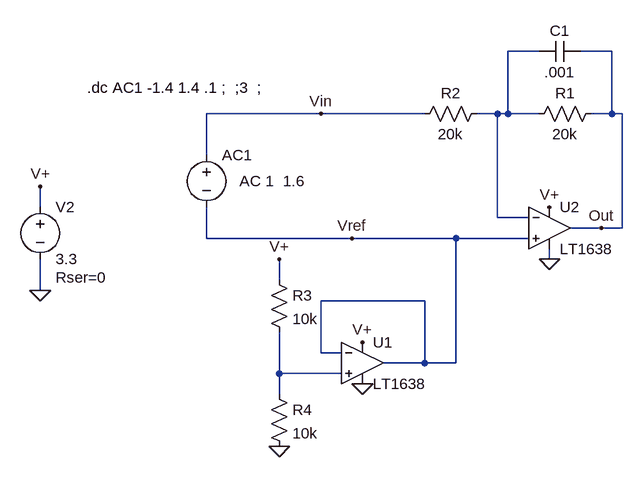
[diagram p0: schematic Current Sensor Amp 1.asc]
Current Sensor Amp 1.asc, the LTspice schematic file:
Version 4
SHEET 1 880 680
WIRE 240 -112 192 -112
WIRE 352 -112 304 -112
WIRE -96 -16 -272 -16
WIRE 64 -16 -96 -16
WIRE 176 -16 144 -16
WIRE 192 -16 192 -112
WIRE 192 -16 176 -16
WIRE 240 -16 192 -16
WIRE 352 -16 352 -112
WIRE 352 -16 320 -16
WIRE 368 -16 352 -16
WIRE -272 48 -272 -16
WIRE -528 128 -528 96
WIRE 176 144 176 -16
WIRE 224 144 176 144
WIRE 336 160 288 160
WIRE 368 160 368 -16
WIRE 368 160 336 160
WIRE -272 176 -272 128
WIRE -48 176 -272 176
WIRE 112 176 -48 176
WIRE 224 176 112 176
WIRE 256 208 256 192
WIRE -160 240 -160 208
WIRE -528 256 -528 208
WIRE 64 272 -96 272
WIRE -96 352 -96 272
WIRE -64 352 -96 352
WIRE 64 368 64 272
WIRE 64 368 0 368
WIRE 112 368 112 176
WIRE 112 368 64 368
WIRE -160 384 -160 320
WIRE -64 384 -160 384
WIRE -160 416 -160 384
FLAG 256 208 0
FLAG 256 128 V+
FLAG 336 160 Out
FLAG -528 256 0
FLAG -528 96 V+
FLAG -48 176 Vref
FLAG -96 -16 Vin
FLAG -32 400 0
FLAG -32 336 V+
FLAG -160 496 0
FLAG -160 208 V+
SYMBOL res 336 -32 R90
WINDOW 0 0 56 VBottom 2
WINDOW 3 32 56 VTop 2
SYMATTR InstName R1
SYMATTR Value 20k
SYMBOL Opamps\\LT1638 256 96 R0
SYMATTR InstName U2
SYMBOL res 160 -32 R90
WINDOW 0 0 56 VBottom 2
WINDOW 3 32 56 VTop 2
SYMATTR InstName R2
SYMATTR Value 20k
SYMBOL voltage -272 32 R0
WINDOW 123 51 56 Left 2
WINDOW 39 0 0 Left 2
WINDOW 3 118 56 Left 2
SYMATTR Value2 AC 1
SYMATTR Value 1.6
SYMATTR InstName AC1
SYMBOL voltage -528 112 R0
WINDOW 123 0 0 Left 2
WINDOW 39 24 124 Left 2
SYMATTR SpiceLine Rser=0
SYMATTR InstName V2
SYMATTR Value 3.3
SYMBOL cap 304 -128 R90
WINDOW 0 0 32 VBottom 2
WINDOW 3 32 32 VTop 2
SYMATTR InstName C1
SYMATTR Value .001
SYMBOL Opamps\\LT1638 -32 304 R0
SYMATTR InstName U1
SYMBOL res -176 224 R0
SYMATTR InstName R3
SYMATTR Value 10k
SYMBOL res -176 400 R0
SYMATTR InstName R4
SYMATTR Value 10k
TEXT -456 -56 Left 2 !.dc AC1 -1.4 1.4 .1 ;  ;3  ;

The netlist it stands for:
* Current Sensor Amp 1.asc
R1 Out N001 20k
XU2 Vref N001 V+ 0 Out LT1638  ; pins In+ In- V+ V- OUT
R2 N001 Vin 20k
V§AC1 Vin Vref 1.6 AC 1
V2 V+ 0 3.3 Rser=0
C1 Out N001 .001
XU1 N002 Vref V+ 0 Vref LT1638  ; pins In+ In- V+ V- OUT
R3 V+ N002 10k
R4 N002 0 10k
.dc AC1 -1.4 1.4 .1 ;  ;3  ;
.backanno
.end

* Results of the author's LTspice run, read from the files saved beside the schematic
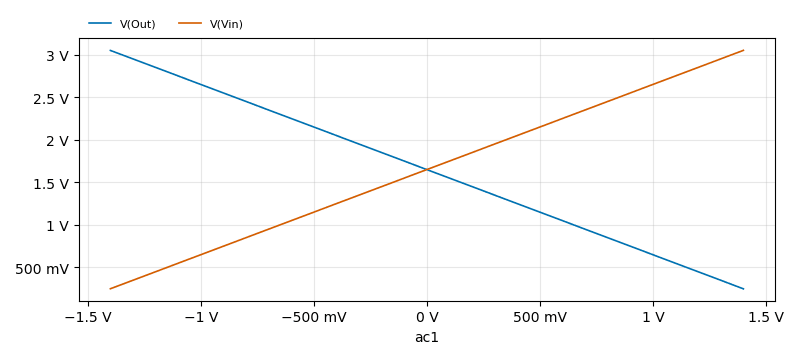
[diagram p1: DC transfer characteristic of Current Sensor Amp 1.asc, plotted from the saved traces]
* DC transfer characteristic, 1 run:
*   V(Out): 3.05 V at ac1=-1.4 V, 249.7 mV at ac1=1.4 V, min 249.7 mV, max 3.05 V
*   V(Vin): 250.1 mV at ac1=-1.4 V, 3.05 V at ac1=1.4 V, min 250.1 mV, max 3.05 V